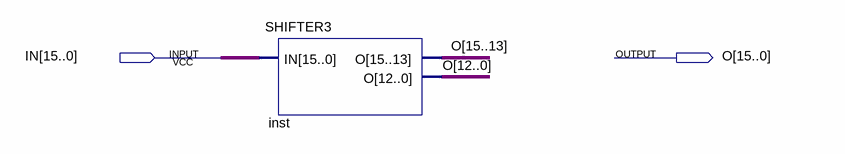
[diagram p0: schematic sheet]
// Quartus schematic SHIFTER3V1.bdf as structural Verilog: 1 symbols, 2 pins
module SHIFTER3V1 (
  input  [15:0] IN,
  output [15:0] O
);

  SHIFTER3 inst (.IN(IN), .O(O));
endmodule
